# EasyEDA Pro project ProPrj_步进电机2.0_2025-09-08.epro

# Schematic Schematic2_1
Board Name: Board2_1; Create Date: 2025-08-29; Page Name: P1_1; Project Name: 步进电机2.0; Schematic Name: Schematic2_1; Update Date: 2025-08-29; Add into BOM: yes; Company: 深圳嘉立创科技发展有限公司; Convert to PCB: yes; Drawed: 嘉立创EDA; Page Size: A3; Part Number: JLCPCB-001; Reviewed: 嘉立创EDA; Version: V0.1
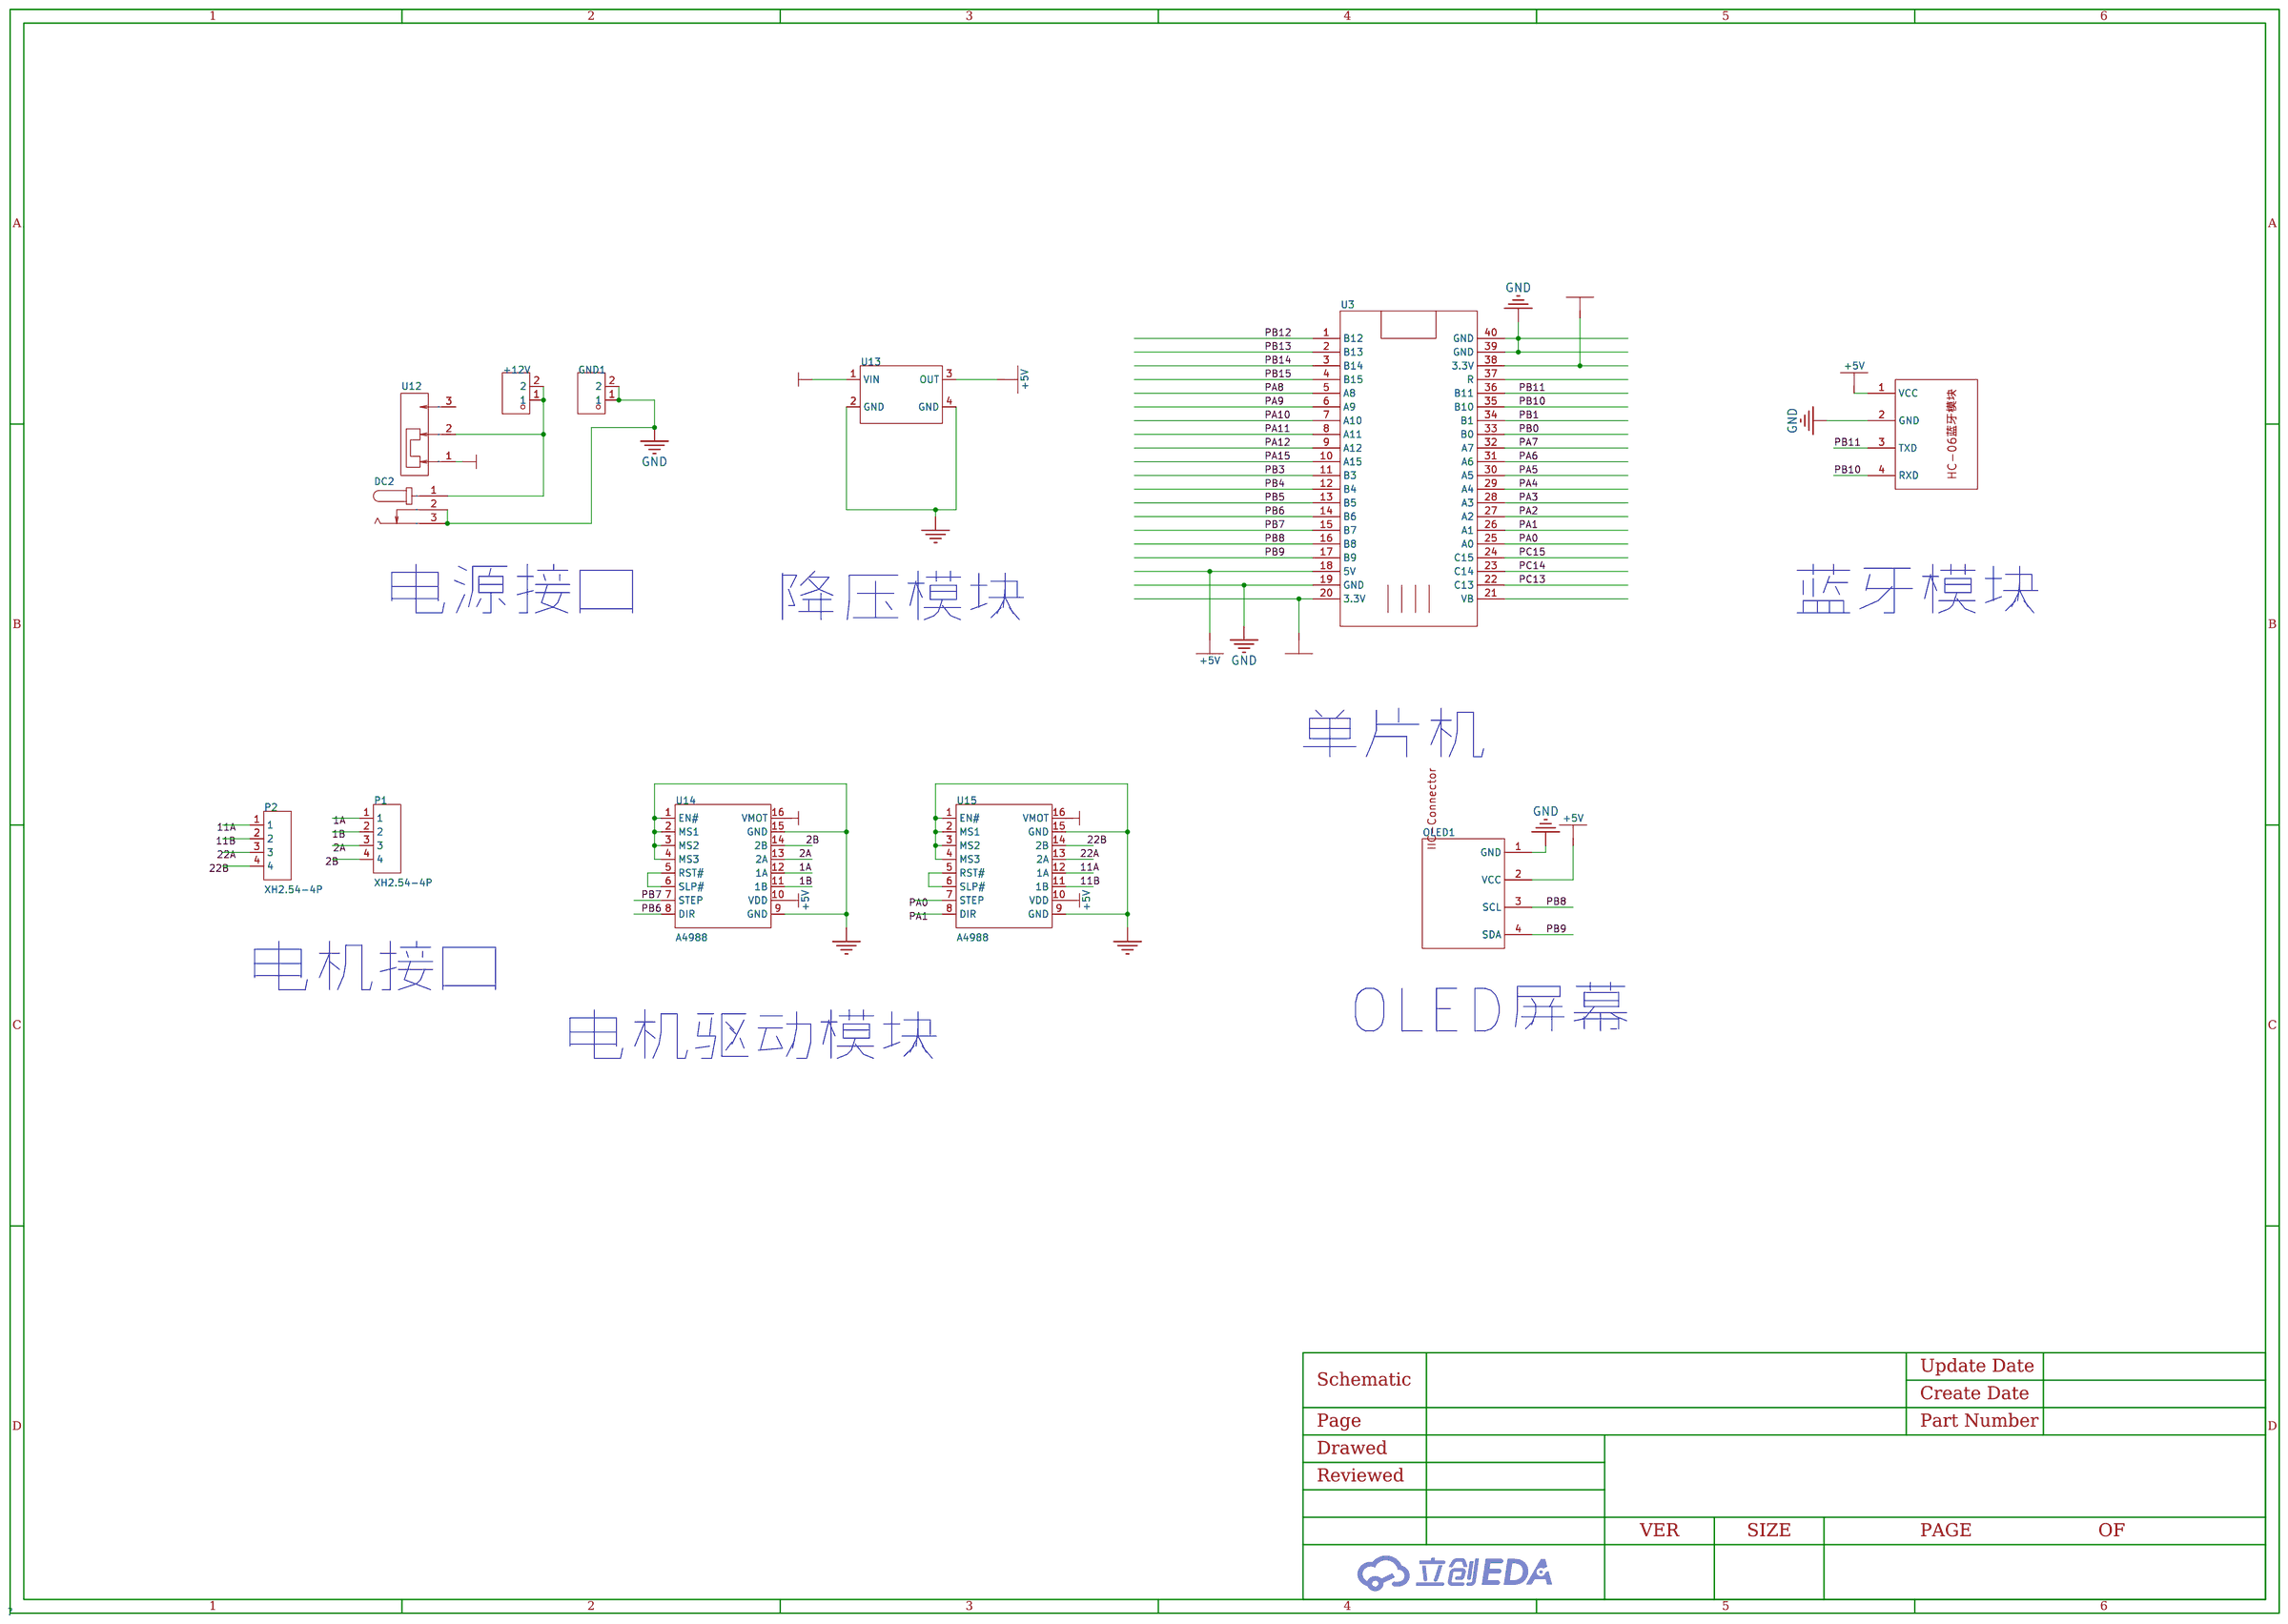
[diagram p0: schematic sheet]

## Parts
+12V  -  [HDR-TH_2P-P2.54-V]
DC2  -  [DC-IN-TH_KH-DC-005-2.5]
GND1  -  [HDR-TH_2P-P2.54-V]
OLED1  -  [0.96OLED_4P]
P1  XH2.54-4P  [CONN-TH_4P-P2.50-XH2.54-4P]
P2  XH2.54-4P  [CONN-TH_4P-P2.50-XH2.54-4P]
U3  -  [STM32F103C8T6核心板]
U6  蓝牙模块HC-06  [DIP-1X4P2.54（HC-06蓝牙模块）]
U12  SS-12D10-G5  [SW-TH_SS-12D10-G050]
U13  -  [MP1584模块]
U14  A4988  [DIP-16_L20.3-W15.2-P2.54_LS12.7_A4988]
U15  A4988  [DIP-16_L20.3-W15.2-P2.54_LS12.7_A4988]

## Library data of the parts
+12V GND1 = 排针2P: 2.54 1*2P 直排针 0.8u镀金 PBT RoHS,针长3*6mm; Supplier Part: C152154; Manufacturer: Nextron(台湾正凌); Manufacturer Part: Z-211-0211-0021-001; LCSC On Sale: 1; Supplier Footprint: Through Hole,P=2.54mm; JLCPCB Part Class: Extended Part; JLCPCB Stock Number: 5280; Datasheet: https://atta.szlcsc.com/upload/public/pdf/source/20171225/C152154_15141883746031203216.pdf; Supplier: LCSC; Number of Positions: 2; Connector Type: 排针; Number of Rows: 1; Mounting Type: 通孔; Contact Type: 公形引脚; Pitch: 0.100; Contact Material: 黄铜
DC2 = KH-DC-005-2.5: 连接器类型:DC电源插座;安装方式:弯插;触点内径:-;触点外径:6.4mm;额定电流:1A;额定电压:30V;工作温度范围:-25~+70;; LCSC Part Name: DC电源插座 外径:6.4mm; Supplier Part: C2847170; Manufacturer: kinghelm(金航标); Supplier Footprint: 插件; JLCPCB Part Class: Extended Part; Datasheet: https://atta.szlcsc.com/upload/public/pdf/source/20210716/C2847170_7F0110A0BEDEE81C68B76DF87AC8DA16.pdf; Supplier: LCSC; Connector Type: DC电源插座; Mounting Style: 弯插; Outside Contact Diameter: 6.4mm; Current Rating (Max): 1A; Voltage Rating (Max): 30V; Operating Temperature Range: -25~+70
OLED1 = 0.96OLED_4P: LCSC Part Name: 0.96OLED_4P_MODULE_JX; Supplier Part: C9900004566; Manufacturer Part: 0.96OLED_4P_MODULE_JX; Supplier Footprint: THrough hole; JLCPCB Part Class: Extended Part; Supplier: LCSC
P1 P2 = XH2.54-4P_C9900003326: Supplier Part: C9900003326; JLCPCB Part Class: 扩展库; Supplier: LCSC
U3 = stm32f103c8t6最小系统板
U6 = 蓝牙模块HC-06: Pin Type: IN
U12 = SS-12D10-G5: 电路结构:单刀双掷;安装方式:直插;开关颜色:黑色;滑钮形状:矩形柱状;引脚样式:PC引脚;开关长度:12.7mm;开关宽度:6.7mm;开关高度:11.3mm;; LCSC Part Name: 插件大电流拨动开关; Supplier Part: C2998777; Manufacturer: DEALON(德艺隆); Supplier Footprint: 插件; JLCPCB Part Class: Extended Part; Datasheet: https://atta.szlcsc.com/upload/public/pdf/source/20220428/E10CB334ACBAF32CF4AF8D87DA871CD3.pdf; Supplier: LCSC; Circuit: 单刀双掷; Mounting Style: 直插; Actuator Color: 黑色; Actuator Style: 矩形柱状; Pin Style: PC引脚; Switch Length: 12.7mm; Switch Width: 6.7mm; Switch Height: 11.3mm
U13 = MP1584模块: Pin Type: IN
U14 U15 = A4988: Supplier Part: C9900168373; Supplier Footprint: 插件; Supplier: LCSC

## Nets
+3.3V: U3.20(3.3V) U3.38(3.3V)
+5V: OLED1.2(VCC) U3.18(5V) U6.1(VCC) U13.3(OUT) U14.10(VDD) U15.10(VDD)
+12V: U12.1 U13.1(VIN) U14.16(VMOT) U15.16(VMOT)
GND: DC2.2 DC2.3 GND1.1 GND1.2 OLED1.1(GND) U3.19(GND) U3.39(GND) U3.40(GND) U6.2(GND) U13.2(GND) U13.4(GND) U14.1(EN#) U14.2(MS1) U14.3(MS2) U14.4(MS3) U14.9(GND) U14.15(GND) U15.1(EN#) U15.2(MS1) U15.3(MS2) U15.4(MS3) U15.9(GND) U15.15(GND)
1A: P1.1 U14.12(1A)
1B: P1.2 U14.11(1B)
2A: P1.3 U14.13(2A)
2B: P1.4 U14.14(2B)
11A: P2.1 U15.12(1A)
11B: P2.2 U15.11(1B)
22A: P2.3 U15.13(2A)
22B: P2.4 U15.14(2B)
PA0: U3.25(A0) U15.7(STEP)
PA1: U3.26(A1) U15.8(DIR)
PA2: U3.27(A2)
PA3: U3.28(A3)
PA4: U3.29(A4)
PA5: U3.30(A5)
PA6: U3.31(A6)
PA7: U3.32(A7)
PA8: U3.5(A8)
PA9: U3.6(A9)
PA10: U3.7(A10)
PA11: U3.8(A11)
PA12: U3.9(A12)
PA15: U3.10(A15)
PB0: U3.33(B0)
PB1: U3.34(B1)
PB3: U3.11(B3)
PB4: U3.12(B4)
PB5: U3.13(B5)
PB6: U3.14(B6) U14.8(DIR)
PB7: U3.15(B7) U14.7(STEP)
PB8: OLED1.3(SCL) U3.16(B8)
PB9: OLED1.4(SDA) U3.17(B9)
PB10: U3.35(B10) U6.4(RXD)
PB11: U3.36(B11) U6.3(TXD)
PB12: U3.1(B12)
PB13: U3.2(B13)
PB14: U3.3(B14)
PB15: U3.4(B15)
PC13: U3.22(C13)
PC14: U3.23(C14)
PC15: U3.24(C15)
$3N3363: +12V.1 +12V.2 DC2.1 U12.2
$3N17205: U14.5(RST#) U14.6(SLP#)
$3N17978: U15.5(RST#) U15.6(SLP#)

Not connected (* = marked no-connect by the designer): U3 21(VB) 37(R); U12 3

## Notes on the sheet
- 电源接口
- 降压模块
- 蓝牙模块
- 单片机
- 电机接口
- OLED屏幕
- 电机驱动模块

# Board 步进电机
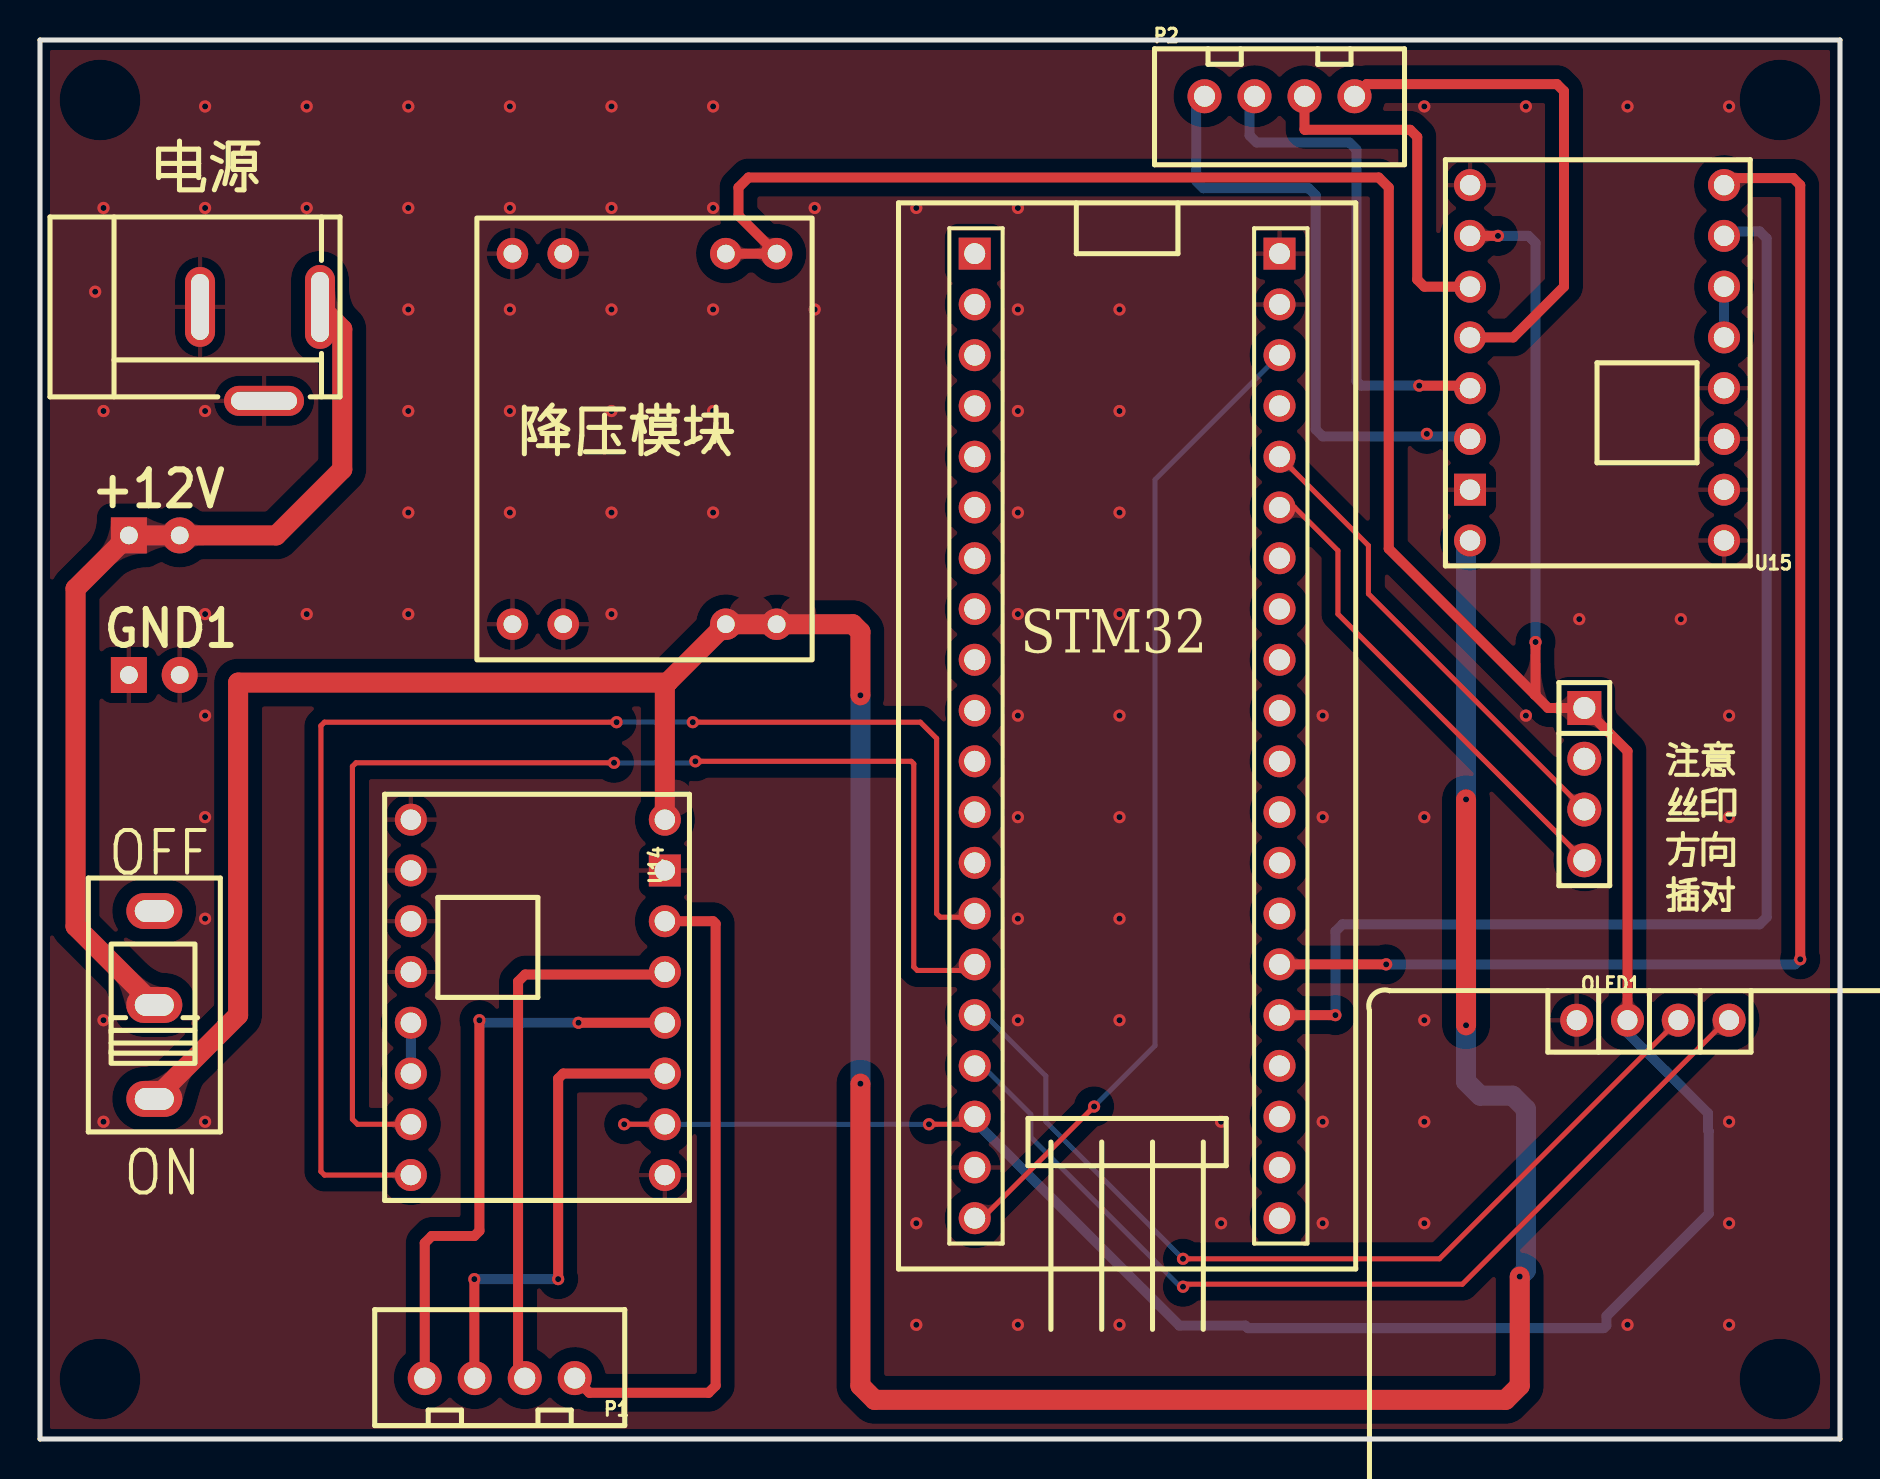
[diagram p1: board, top side]
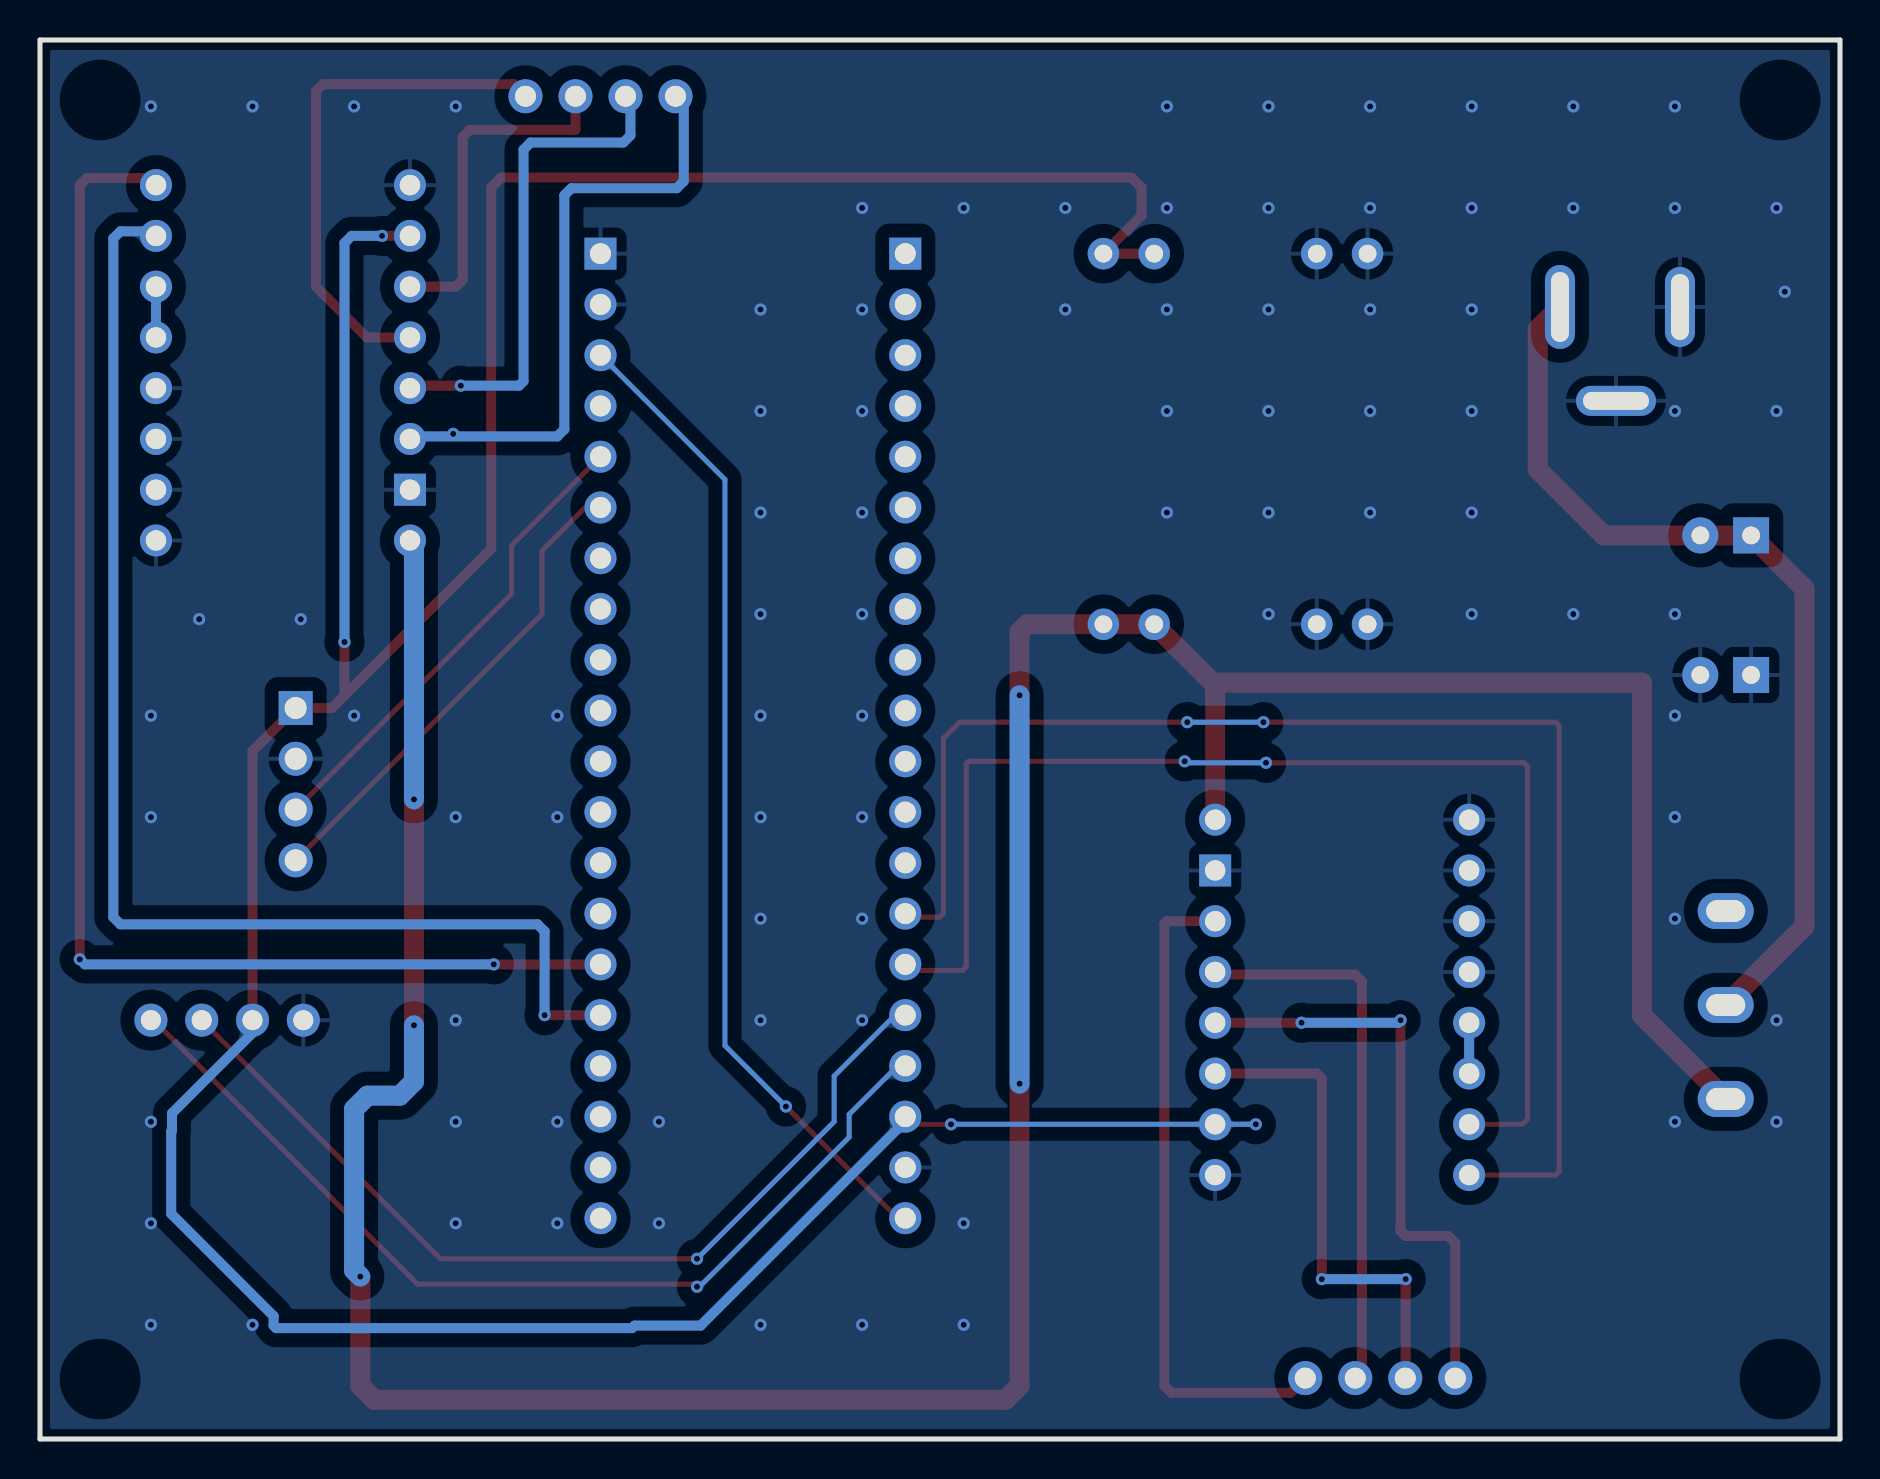
[diagram p2: board, bottom side, seen from below]

Outline 90 x 70 mm; copper layers: Top Layer, Bottom Layer. Coordinates in mm from the lower left corner of the outline.
Outline path: 0,70 90,70 90,0 0,0 0,70
Stack: Top Layer 0.035mm / Dielectric1 1.51mm FR4 er 4.5 / Bottom Layer 0.035mm

## Design rules (mm)
spacing safeClearance (default): track to track 0.152, other pairs 0.152 to 0.3
track width trackWidth (default): min 0.127, default 0.254, max 2.54
differential pair differentialPair (default): width min 0.127, default 0.254, max 2.54; gap min 0.152, default 0.152
via viaSize (default): diameter min 0.5, default 0.61, max 10; hole min 0.3, default 0.305, max 6
template: 用户自定义配置
spacing safeClearance (default): track to track 0.5, other pairs 0.5 to 0.5
track width trackWidth (default): min 0.127, default 0.254, max 2.54
differential pair differentialPair (default): width min 0.127, default 0.254, max 2.54; gap min 0.152, default 0.152
via viaSize (default): diameter min 0.5, default 0.61, max 10; hole min 0.3, default 0.305, max 6

## Placement (name value [footprint] x y rotation side)
+12V  -  [HDR-TH_2P-P2.54-V]  5.72 45.21 0 top
DC2  -  [DC-IN-TH_KH-DC-005-2.5]  11 54.29 0 top
GND1  -  [HDR-TH_2P-P2.54-V]  5.72 38.23 0 top
OLED1  -  [0.96OLED_4P]  80.64 20.95 0 top
P1  XH2.54-4P  [CONN-TH_4P-P2.50-XH2.54-4P]  22.99 3.05 180 top
P2  XH2.54-4P  [CONN-TH_4P-P2.50-XH2.54-4P]  61.98 67.18 0 top
U3  -  [STM32F103C8T6核心板]  54.36 35.18 0 top
U6  蓝牙模块HC-06  [DIP-1X4P2.54（HC-06蓝牙模块）]  77.22 32.77 180 top
U12  SS-12D10-G5  [SW-TH_SS-12D10-G050]  5.72 21.72 90 top
U13  -  [MP1584模块]  30.23 50.04 90 top
U14  A4988  [DIP-16_L20.3-W15.2-P2.54_LS12.7_A4988]  24.89 22.1 0 top
U15  A4988  [DIP-16_L20.3-W15.2-P2.54_LS12.7_A4988]  77.85 53.85 180 top

## Footprints (pads in the part's own frame, mm; a bottom-side part is the same pattern mirrored in y, then rotated)
0.96OLED_4P
  round 1.651 hole 1.001: 1(-3.81,0) 2(-1.27,0.003) 3(1.27,0.003) 4(3.81,0.003)
CONN-TH_4P-P2.50-XH2.54-4P
  round 1.7 hole 1.05: 1(3.75,0) 2(1.25,0) 3(-1.25,0) 4(-3.75,0)
DC-IN-TH_KH-DC-005-2.5
  oval 1.501x4.201 hole 0.899x3.5: 1(2.999,2.349)
  oval 1.501x4 hole 0.899x3.3: 2(-2.999,2.349)
  oval 4x1.501 hole 3.3x0.899: 3(0.201,-2.349)
DIP-1X4P2.54（HC-06蓝牙模块）
  rect 1.7x1.7 hole 1.1: 1(0,-3.81)
  round 1.7 hole 1.1: 2(0,-1.27) 3(0,1.27) 4(0,3.81)
DIP-16_L20.3-W15.2-P2.54_LS12.7_A4988
  round 1.6 hole 1.02: 1(-6.35,8.89) 2(-6.35,6.35) 3(-6.35,3.81) 4(-6.35,1.27) 5(-6.35,-1.27) 6(-6.35,-3.81) 7(-6.35,-6.35) 8(-6.35,-8.89) 9(6.35,-8.89) 10(6.35,-6.35) 11(6.35,-3.81) 12(6.35,-1.27) 13(6.35,1.27) 14(6.35,3.81) 16(6.35,8.89)
  rect 1.6x1.6 hole 1.02: 15(6.35,6.35)
HDR-TH_2P-P2.54-V
  rect 1.801x1.801 hole 0.889: 1(-1.27,0)
  round 1.801 hole 0.889: 2(1.27,0)
MP1584模块
  round 1.575 hole 0.889: 1(-9.271,-4.064) 1(-9.271,-6.604) 2(-9.271,6.604) 2(-9.271,4.064) 3(9.271,-4.064) 3(9.271,-6.604) 4(9.271,6.604) 4(9.271,4.064)
STM32F103C8T6核心板
  rect 1.6x1.6 hole 1.049: 1(-7.62,24.13) 40(7.62,24.13)
  round 1.6 hole 1.049: 2(-7.62,21.59) 3(-7.62,19.05) 4(-7.62,16.51) 5(-7.62,13.97) 6(-7.62,11.43) 7(-7.62,8.89) 8(-7.62,6.35) 9(-7.62,3.81) 10(-7.62,1.27) 11(-7.62,-1.27) 12(-7.62,-3.81) 13(-7.62,-6.35) 14(-7.62,-8.89) 15(-7.62,-11.43) 16(-7.62,-13.97) 17(-7.62,-16.51) 18(-7.62,-19.05) 19(-7.62,-21.59) 20(-7.62,-24.13) 21(7.62,-24.13) 22(7.62,-21.59) 23(7.62,-19.05) 24(7.62,-16.51) 25(7.62,-13.97) 26(7.62,-11.43) 27(7.62,-8.89) 28(7.62,-6.35) 29(7.62,-3.81) 30(7.62,-1.27) 31(7.62,1.27) 32(7.62,3.81) 33(7.62,6.35) 34(7.62,8.89) 35(7.62,11.43) 36(7.62,13.97) 37(7.62,16.51) 38(7.62,19.05) 39(7.62,21.59)
SW-TH_SS-12D10-G050
  oval 1.8x2.8 hole 1.1x1.95: 1(-4.7,0) 2(0,0) 3(4.7,0)

## Nets
As in the schematic.

Pads without a net: U12 3

## Via types
v1: diameter 0.61, hole 0.305, Top Layer to Bottom Layer, 25 vias
v2: diameter 0.61, hole 0.304, Top Layer to Bottom Layer, 85 vias

## Routing (per net, layer and track width the routed paths; a pad name or vN(x,y) marks a point on that pad's centre or on a via; arc(x,y) is an arc through that point)
+3.3V: length 49.7
  Top Layer w0.25: v1(52.7,16.64) 47.12,11.05 U3.20
  Bottom Layer w0.25: U3.38 55.75,48.01 55.75,19.68 v1(52.7,16.64)
+5V: length 188.2
  Top Layer w0.254: U3.18 46.36,15.75 v1(44.45,15.75) ; U14.10 v1(29.21,15.75)
  Top Layer w0.5: 74.74,37.24 74.78,37.28 v1(74.78,39.88) ; 74.74,37.24 75.41,36.58 U6.1 79.38,34.42 OLED1.2 ; 74.74,37.24 67.44,44.54 67.44,62.62 66.94,63.12 35.42,63.12 34.92,62.62 34.92,61.21 36.83,59.31 U13.3 ; U15.10 v1(72.9,60.2)
  Bottom Layer w0.254: v1(29.21,15.75) U14.10 v1(44.45,15.75)
  Bottom Layer w0.5: v1(72.9,60.2) 74.42,60.2 74.78,59.84 v1(74.78,39.88) ; OLED1.2 79.38,20.32 83.4,16.3 83.4,15.44 83.44,15.4 83.44,11.27 78.32,6.15 78.32,5.68 78.19,5.55 60.4,5.55 60.27,5.68 56.97,5.68 46.74,15.91 U3.18
+12V: length 177.9
  Top Layer w1: 31.37,37.85 31.24,37.72 U14.16 ; 31.37,37.85 U13.1 40.64,40.77 41.02,40.39 v1(41.02,37.21) ; 31.37,37.85 9.91,37.85 9.91,21.21 U12.1 ; v1(73.99,8.13) 73.99,2.67 73.28,1.96 41.73,1.96 41.02,2.67 v1(41.02,17.78) ; v1(71.3,20.7) v1(71.3,32)
  Bottom Layer w1: v1(71.3,32) 71.3,44.76 U15.16 ; v1(73.99,8.13) 74.3,8.44 74.3,16.51 73.63,17.18 72.01,17.18 71.3,17.89 v1(71.3,20.7) ; v1(41.02,37.21) v1(41.02,17.78)
GND:
  vias: v2(2.76,57.4) v2(3.18,61.59) v2(3.18,51.43) v2(3.18,20.95) v2(3.18,15.87) v2(8.26,66.67) v2(8.26,61.59) v2(8.26,51.43) v2(8.26,41.27) v2(8.26,36.19) v2(8.26,31.11) v2(8.26,26.03) v2(8.26,15.87) v2(13.34,66.67) v2(13.34,61.59) v2(13.34,41.27) v2(18.42,66.67) v2(18.42,61.59) v2(18.42,56.51) v2(18.42,51.43) v2(18.42,46.35) v2(18.42,41.27) v2(23.5,66.67) v2(23.5,61.59) v2(23.5,56.51) v2(23.5,51.43) v2(23.5,46.35) v2(28.58,66.67) v2(28.58,61.59) v2(28.58,56.51) v2(28.58,51.43) v2(28.58,46.35) v2(28.58,41.27) v2(33.66,66.67) v2(33.66,61.59) v2(33.66,56.51) v2(33.66,51.43) v2(33.66,46.35) v2(38.73,61.59) v2(38.73,56.51) v2(43.82,61.59) v2(43.82,10.79) v2(43.82,5.72) v2(48.89,61.59) v2(48.89,56.51) v2(48.89,51.43) v2(48.89,46.35) v2(48.89,41.27) v2(48.89,36.19) v2(48.89,31.11) v2(48.89,26.03) v2(48.89,20.95) v2(48.89,5.72) v2(53.98,56.51) v2(53.98,51.43) v2(53.98,46.35) v2(53.98,41.27) v2(53.98,36.19) v2(53.98,31.11) v2(53.98,26.03) v2(53.98,20.95) v2(53.98,5.72) v2(59.05,15.87) v2(59.05,10.79) v2(64.14,36.19) v2(64.14,31.11) v2(64.14,15.87) v2(64.14,10.79) v2(69.22,66.67) v2(69.22,31.11) v2(69.22,20.95) v2(69.22,15.87) v2(69.22,10.79) v2(74.3,66.67) v2(74.3,36.19) v2(76.96,41.02) v2(79.38,66.67) v2(79.38,5.72) v2(82.04,41.02) v2(84.45,66.67) v2(84.45,36.19) v2(84.45,31.11) v2(84.45,15.87) v2(84.45,10.79) v2(84.45,5.72)
1A: length 29.6
  Top Layer w0.5: U14.12 v1(26.92,20.83) ; P1.1 19.24,9.81 19.59,10.16 21.72,10.16 21.97,10.41 v1(21.97,20.95)
  Bottom Layer w0.5: v1(21.97,20.95) 22.1,20.83 v1(26.92,20.83)
1B: length 24.6
  Top Layer w0.5: 31.24,18.29 26.16,18.29 25.91,18.03 v1(25.91,8) ; P1.2 21.72,3.07 v1(21.72,8)
  Bottom Layer w0.5: v1(25.91,8) v1(21.72,8)
2A: length 27.5
  Top Layer w0.5: P1.3 23.9,3.38 23.9,22.89 24.26,23.24 31.11,23.24 31.24,23.37
2B: length 33.2
  Top Layer w0.5: P1.4 27.47,2.31 33.43,2.31 33.78,2.67 33.78,25.78 33.66,25.91 U14.14
11A: length 26.4
  Top Layer w0.5: U15.12 73.66,55.12 76.2,57.66 76.2,67.44 75.85,67.79 66.33,67.79 P2.1
11B: length 17.4
  Top Layer w0.5: P2.2 63.23,65.52 63.25,65.5 68.51,65.5 68.86,65.15 68.86,58.01 69.22,57.66 U15.11
22A: length 25.1
  Top Layer w0.5: U15.13 71.37,52.7 v1(68.96,52.7)
  Bottom Layer w0.5: P2.3 60.48,66.94 60.48,65.22 60.83,64.87 65.47,64.87 65.82,64.52 65.82,52.93 66.05,52.7 v1(68.96,52.7)
22B: length 30.3
  Bottom Layer w0.5: U15.14 71.37,50.16 64.14,50.16 63.78,50.52 63.78,62.23 63.43,62.58 58.17,62.58 57.81,62.94 57.81,66.77 P2.4
  vias: v1(69.34,50.29)
PA0: length 65.2
  Top Layer w0.5: U3.25 v1(64.77,21.21)
  Bottom Layer w0.5: U15.7 84.43,60.42 85.98,60.42 86.33,60.07 86.33,26.11 85.98,25.75 65.12,25.75 64.77,25.4 v1(64.77,21.21)
PA1: length 69
  Top Layer w0.5: U3.26 v1(67.31,23.75) ; v1(88.01,24) 88.01,62.74 87.66,63.09 84.55,63.09 U15.8
  Bottom Layer w0.5: v1(67.31,23.75) 87.76,23.75 v1(88.01,24)
PB6: length 68.9
  Top Layer w0.254: v1(32.64,35.87) 44.02,35.87 44.83,35.05 44.83,26.29 45.01,26.11 46.56,26.11 U3.14 ; v1(28.83,35.87) 14.22,35.87 14.04,35.69 14.04,13.39 14.22,13.21 18.54,13.21
  Bottom Layer w0.254: v1(28.83,35.87) v1(32.64,35.87)
PB7: length 62.3
  Top Layer w0.254: 18.54,15.75 15.88,15.75 15.62,16 15.62,33.65 15.8,33.83 v1(28.7,33.83) ; v1(32.77,33.91) 43.56,33.91 43.69,33.78 43.69,23.62 43.87,23.44 46.43,23.44 U3.15
  Bottom Layer w0.254: v1(32.77,33.91) 32.69,33.83 v1(28.7,33.83)
PB8: length 46.5
  Top Layer w0.25: OLED1.3 69.97,9.02 v1(57.15,9.02)
  Bottom Layer w0.25: v1(57.15,9.02) 50.29,15.87 50.29,18.16 47.24,21.21 U3.16
PB9: length 48.5
  Top Layer w0.25: OLED1.4 84.33,20.96 71.12,7.75 57.28,7.75 v1(57.15,7.62)
  Bottom Layer w0.25: v1(57.15,7.62) 57.02,7.62 49.54,15.1 49.54,16.24 47.12,18.67 U3.17
PB10: length 24.4
  Top Layer w0.25: U6.4 64.9,41.27 64.9,44.45 62.74,46.61 U3.35
PB11: length 24
  Top Layer w0.25: U3.36 66.42,44.7 66.42,42.29 U6.3
$3N3363: length 46.9
  Top Layer w1: DC2.1 15.11,55.53 15.11,48.51 11.81,45.21 +12V.2 +12V.1 1.78,42.54 1.78,25.65 U12.2
$3N17205: length 2.5
  Bottom Layer w0.5: 18.54,20.83 18.54,18.29
$3N17978: length 2.5
  Bottom Layer w0.5: U15.6 U15.5

## Copper pours and planes (outline as drawn; the poured copper is in the pictures)
GND on Top Layer: -12.7,75.95 102.74,75.95 102.74,-10.41 -12.7,-10.41
GND on Top Layer: -5.46,74.93 93.73,74.93 93.73,-6.48 -5.46,-6.48
GND on Bottom Layer: -11.81,80.9 100.46,80.9 100.46,-12.95 -11.81,-12.95

Small or netless copper shapes (teardrops, artwork), in the pictures only: 50 on Top Layer, 22 on Bottom Layer

## Text on the board
Top Silkscreen Layer: OFF | ON | 注意 / 丝印 / 方向 / 插对 | 电源 | 降压模块 | STM32
